# EAGLE schematic Transmitter (EAGLE 7.6.0)
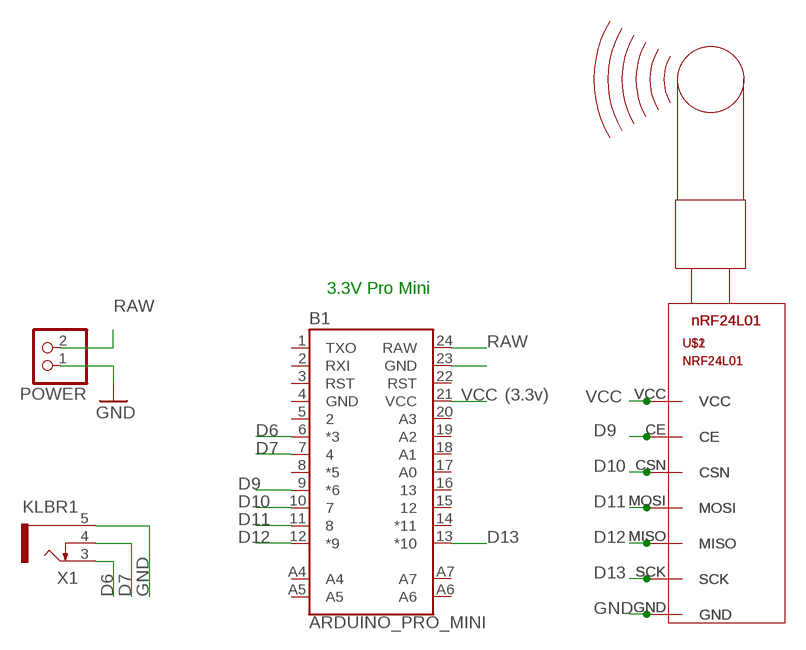
[diagram p0: schematic, sheet 1]

## Parts
B1  ARDUINO_PRO_MINI  [ARDUINO_PRO_MINI]
POWER  PINHD-1X2  [1X02]
U$1  NRF24L01  [NRF24L01]
U$2  NRF24L01  [NRF24L01]
X1  KLBR1  [KLBR1]

## Nets
D6: B1.6(*3) X1.3
D7: B1.7 X1.4
D9: B1.9(*6) U$1.CE U$2.CE
D10: B1.10 U$1.CSN U$2.CSN
D11: B1.11 U$1.MOSI U$2.MOSI
D12: B1.12(*9) U$1.MISO U$2.MISO
D13: B1.13(*10) U$1.SCK U$2.SCK
GND: B1.23(GND) POWER.1 U$1.GND U$2.GND X1.5
RAW: B1.24(RAW) POWER.2
VCC: B1.21(VCC) U$1.VCC U$2.VCC
Unconnected: B1.1(TXO) B1.2(RXI) B1.3(RST) B1.5 B1.8(*5) B1.14(*11) B1.15 B1.16 B1.17(A0) B1.18(A1) B1.19(A2) B1.20(A3) B1.22(RST) B1.A4 B1.A5 B1.A6 B1.A7

## Notes on the sheet
- 3.3V Pro Mini
- (3.3v)

## Power pins joined to a net without a drawn wire
GND: B1.4(GND)

## Library data of the parts
B1 = SparkFun-Boards:ARDUINO_PRO_MINI: SparkFun Pro Mini Pro Mini compatible footprint. Dimensions: 0.7 x 1.3" PCB Thickness: 0.8mm SparkFun Products: 3.3V/8MHz <https://www.sparkfun.com/products/11114> 5V/16MHz <https://www.sparkfun.com/products/11113>
POWER = pinhead:PINHD-1X2: PIN HEADER
U$1 U$2 = Clean-Kong (1):NRF24L01: nrF54L01 2.4GHz with 100 Channels Emitter/Reveiver SPI Controlled Roboshop / Minint
X1 = con-lumberg:KLBR?: Jack connectors according to JISC 6560, 2.5mm / 3.5 mm Klinkensteckverbinder nach JISC 6560, 2.5mm / 3,5 mm Source: http://www.lumberg.com/Produkte/PDFs/KLBR2.pdf www.lumberg.com/Produkte/PDFs/KLBR1.pdf; MPN: KLBR 1; OC_FARNELL: 1200140; OC_NEWARK: 97K2707